# EAGLE design alu (EAGLE 9.6.2)
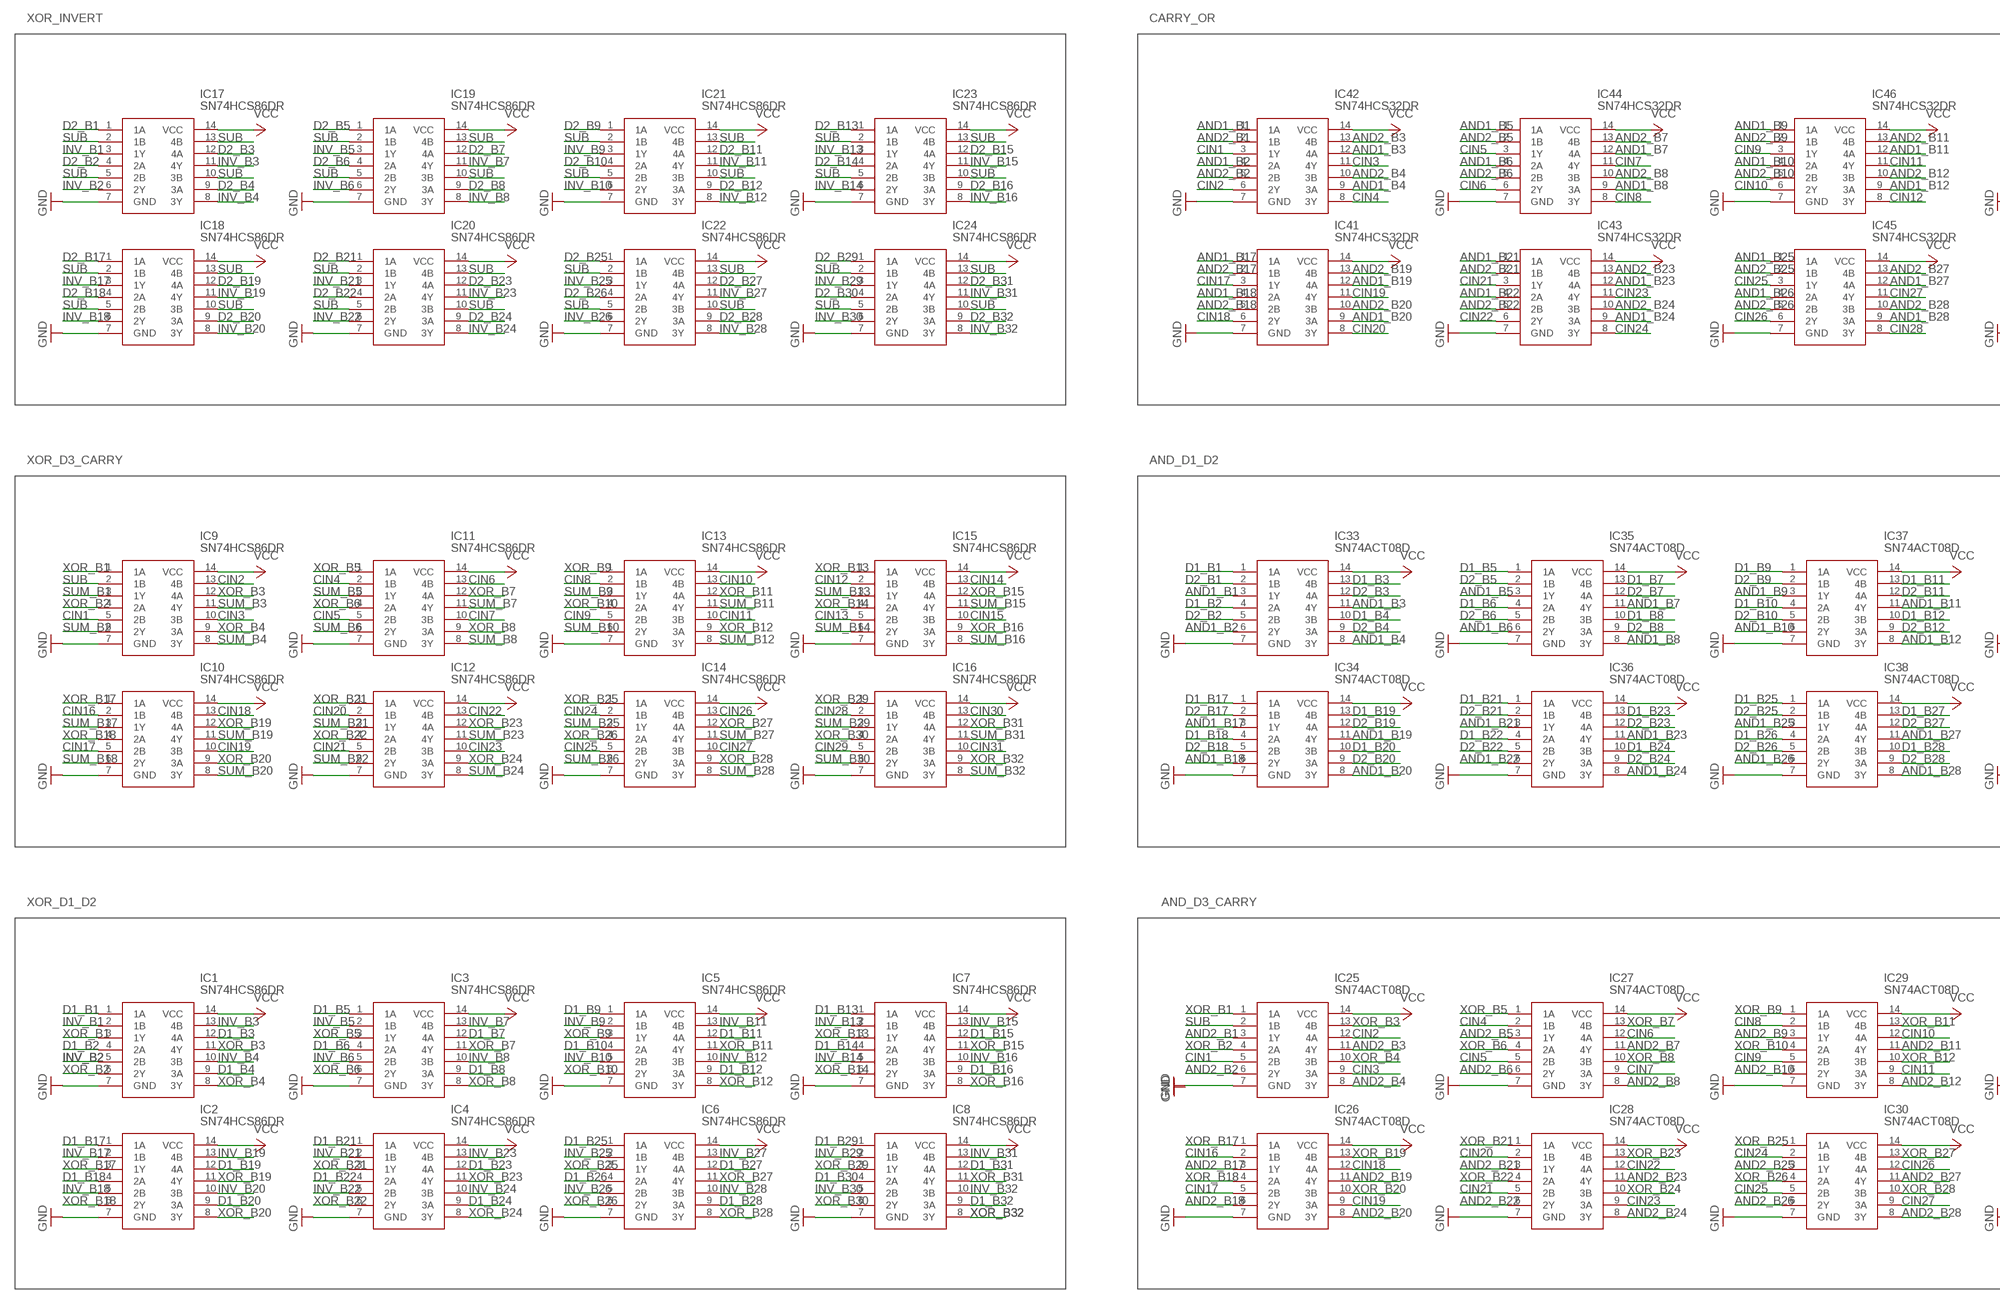
[diagram p0: schematic, sheet 1, part 1 of 2]
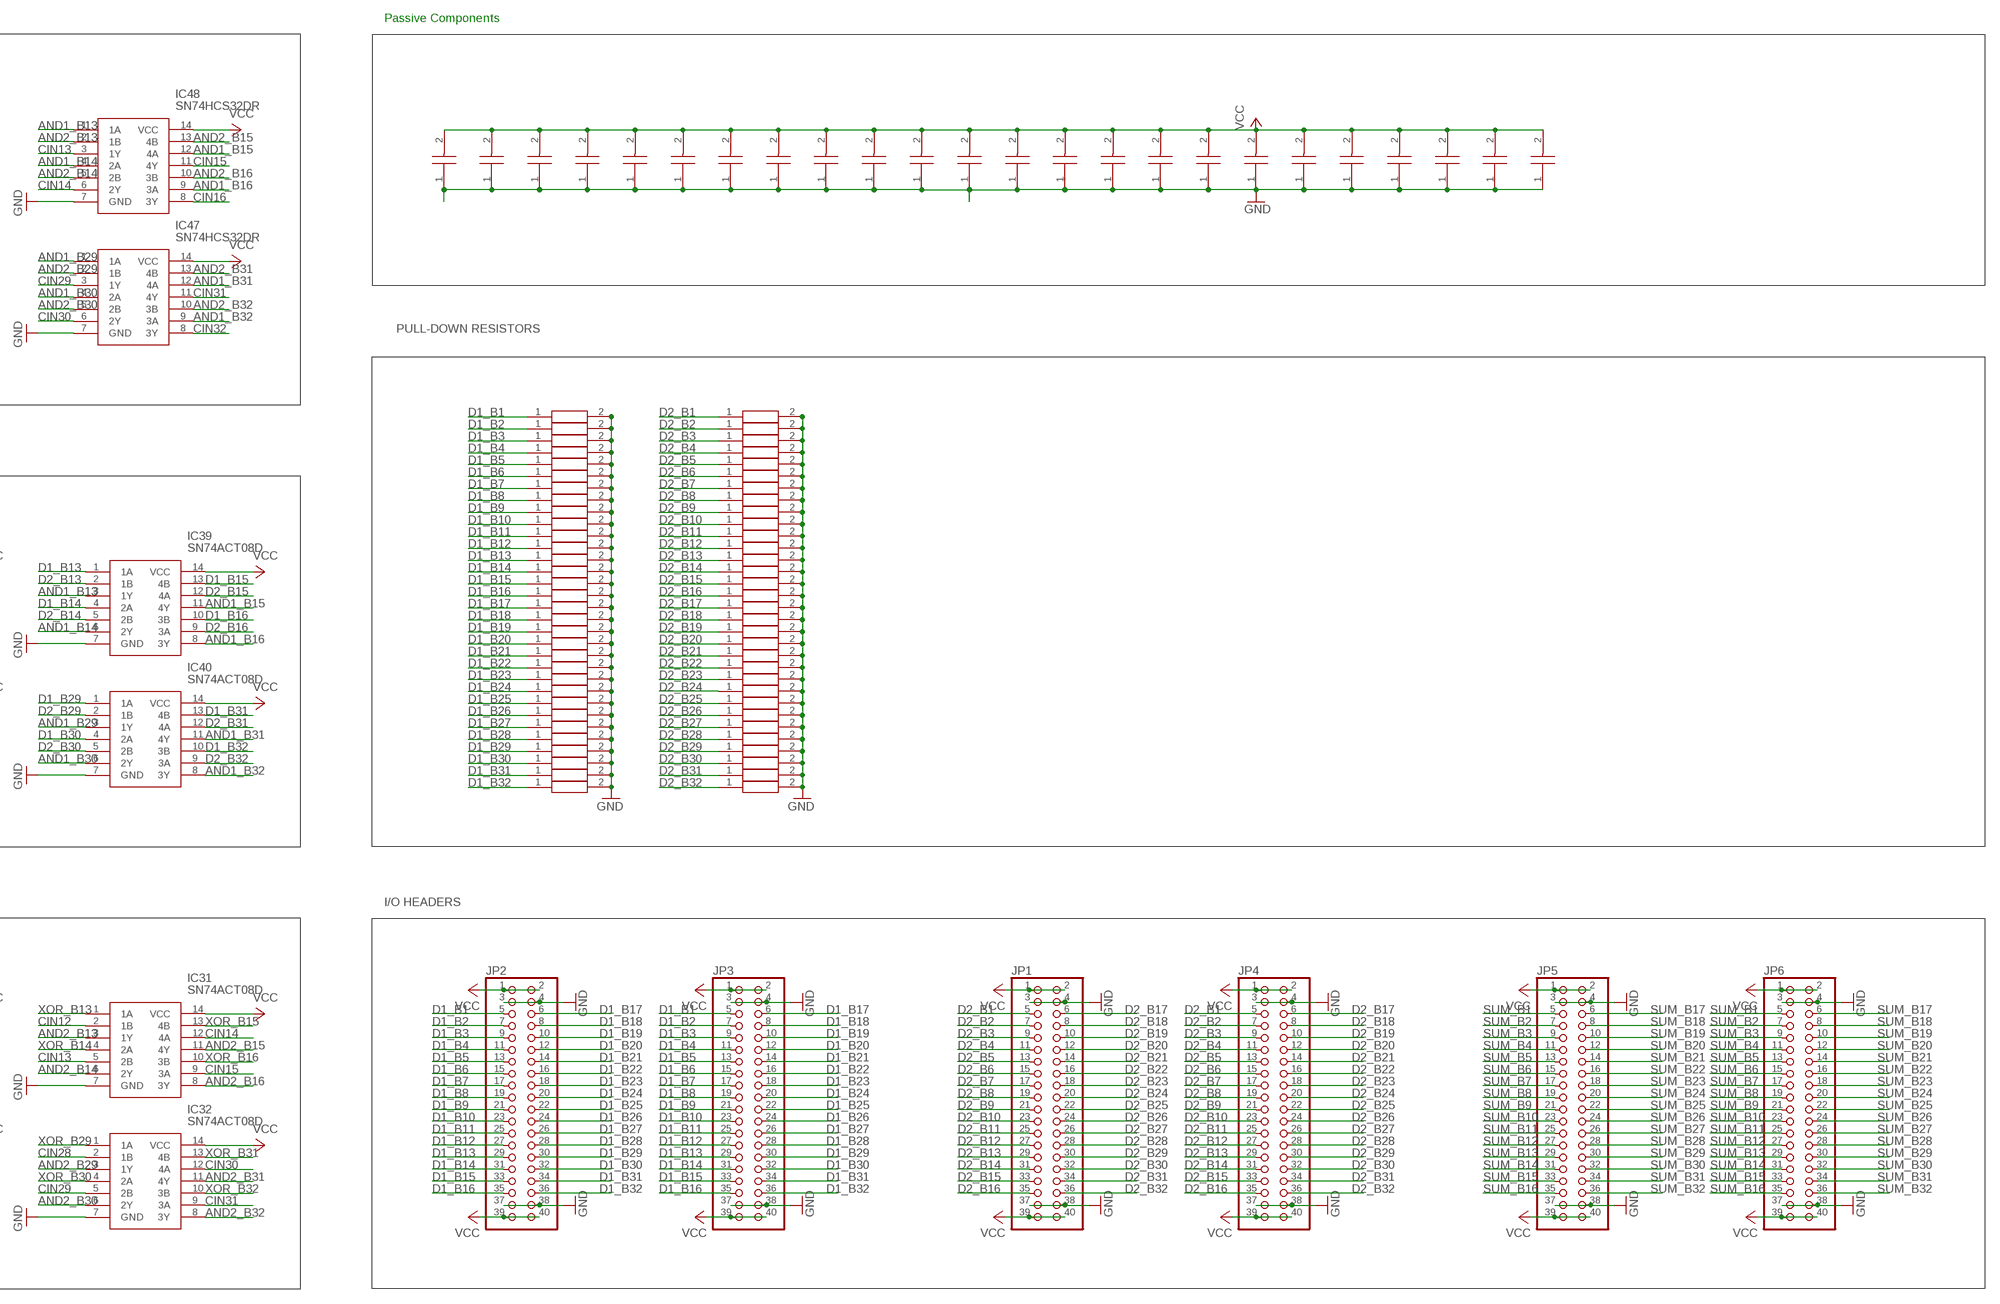
[diagram p1: schematic, sheet 1, part 2 of 2]

## Parts
C1  CC0603KRX7R9BB104  [CAPC1608X90N]
C2  CC0603KRX7R9BB104  [CAPC1608X90N]
C3  CC0603KRX7R9BB104  [CAPC1608X90N]
C4  CC0603KRX7R9BB104  [CAPC1608X90N]
C5  CC0603KRX7R9BB104  [CAPC1608X90N]
C6  CC0603KRX7R9BB104  [CAPC1608X90N]
C7  CC0603KRX7R9BB104  [CAPC1608X90N]
C8  CC0603KRX7R9BB104  [CAPC1608X90N]
C9  CC0603KRX7R9BB104  [CAPC1608X90N]
C10  CC0603KRX7R9BB104  [CAPC1608X90N]
C11  CC0603KRX7R9BB104  [CAPC1608X90N]
C12  CC0603KRX7R9BB104  [CAPC1608X90N]
C13  CC0603KRX7R9BB104  [CAPC1608X90N]
C14  CC0603KRX7R9BB104  [CAPC1608X90N]
C15  CC0603KRX7R9BB104  [CAPC1608X90N]
C16  CC0603KRX7R9BB104  [CAPC1608X90N]
C17  CC0603KRX7R9BB104  [CAPC1608X90N]
C18  CC0603KRX7R9BB104  [CAPC1608X90N]
C19  CC0603KRX7R9BB104  [CAPC1608X90N]
C20  CC0603KRX7R9BB104  [CAPC1608X90N]
C21  CC0603KRX7R9BB104  [CAPC1608X90N]
C22  CC0603KRX7R9BB104  [CAPC1608X90N]
C23  CC0603KRX7R9BB104  [CAPC1608X90N]
C24  CC0603KRX7R9BB104  [CAPC1608X90N]
IC1  SN74HCS86DR  [SOIC127P600X175-14N]
IC2  SN74HCS86DR  [SOIC127P600X175-14N]
IC3  SN74HCS86DR  [SOIC127P600X175-14N]
IC4  SN74HCS86DR  [SOIC127P600X175-14N]
IC5  SN74HCS86DR  [SOIC127P600X175-14N]
IC6  SN74HCS86DR  [SOIC127P600X175-14N]
IC7  SN74HCS86DR  [SOIC127P600X175-14N]
IC8  SN74HCS86DR  [SOIC127P600X175-14N]
IC9  SN74HCS86DR  [SOIC127P600X175-14N]
IC10  SN74HCS86DR  [SOIC127P600X175-14N]
IC11  SN74HCS86DR  [SOIC127P600X175-14N]
IC12  SN74HCS86DR  [SOIC127P600X175-14N]
IC13  SN74HCS86DR  [SOIC127P600X175-14N]
IC14  SN74HCS86DR  [SOIC127P600X175-14N]
IC15  SN74HCS86DR  [SOIC127P600X175-14N]
IC16  SN74HCS86DR  [SOIC127P600X175-14N]
IC17  SN74HCS86DR  [SOIC127P600X175-14N]
IC18  SN74HCS86DR  [SOIC127P600X175-14N]
IC19  SN74HCS86DR  [SOIC127P600X175-14N]
IC20  SN74HCS86DR  [SOIC127P600X175-14N]
IC21  SN74HCS86DR  [SOIC127P600X175-14N]
IC22  SN74HCS86DR  [SOIC127P600X175-14N]
IC23  SN74HCS86DR  [SOIC127P600X175-14N]
IC24  SN74HCS86DR  [SOIC127P600X175-14N]
IC25  SN74ACT08D  [SOIC127P600X175-14N]
IC26  SN74ACT08D  [SOIC127P600X175-14N]
IC27  SN74ACT08D  [SOIC127P600X175-14N]
IC28  SN74ACT08D  [SOIC127P600X175-14N]
IC29  SN74ACT08D  [SOIC127P600X175-14N]
IC30  SN74ACT08D  [SOIC127P600X175-14N]
IC31  SN74ACT08D  [SOIC127P600X175-14N]
IC32  SN74ACT08D  [SOIC127P600X175-14N]
IC33  SN74ACT08D  [SOIC127P600X175-14N]
IC34  SN74ACT08D  [SOIC127P600X175-14N]
IC35  SN74ACT08D  [SOIC127P600X175-14N]
IC36  SN74ACT08D  [SOIC127P600X175-14N]
IC37  SN74ACT08D  [SOIC127P600X175-14N]
IC38  SN74ACT08D  [SOIC127P600X175-14N]
IC39  SN74ACT08D  [SOIC127P600X175-14N]
IC40  SN74ACT08D  [SOIC127P600X175-14N]
IC41  SN74HCS32DR  [SOIC127P600X175-14N]
IC42  SN74HCS32DR  [SOIC127P600X175-14N]
IC43  SN74HCS32DR  [SOIC127P600X175-14N]
IC44  SN74HCS32DR  [SOIC127P600X175-14N]
IC45  SN74HCS32DR  [SOIC127P600X175-14N]
IC46  SN74HCS32DR  [SOIC127P600X175-14N]
IC47  SN74HCS32DR  [SOIC127P600X175-14N]
IC48  SN74HCS32DR  [SOIC127P600X175-14N]
JP1  PINHD-2X20  [2X20]
JP2  PINHD-2X20  [2X20]
JP3  PINHD-2X20  [2X20]
JP4  PINHD-2X20  [2X20]
JP5  PINHD-2X20  [2X20]
JP6  PINHD-2X20  [2X20]
R1  RC0603FR-0710KL  [RESC1608X55N]
R2  RC0603FR-0710KL  [RESC1608X55N]
R3  RC0603FR-0710KL  [RESC1608X55N]
R4  RC0603FR-0710KL  [RESC1608X55N]
R5  RC0603FR-0710KL  [RESC1608X55N]
R6  RC0603FR-0710KL  [RESC1608X55N]
R7  RC0603FR-0710KL  [RESC1608X55N]
R8  RC0603FR-0710KL  [RESC1608X55N]
R9  RC0603FR-0710KL  [RESC1608X55N]
R10  RC0603FR-0710KL  [RESC1608X55N]
R11  RC0603FR-0710KL  [RESC1608X55N]
R12  RC0603FR-0710KL  [RESC1608X55N]
R13  RC0603FR-0710KL  [RESC1608X55N]
R14  RC0603FR-0710KL  [RESC1608X55N]
R15  RC0603FR-0710KL  [RESC1608X55N]
R16  RC0603FR-0710KL  [RESC1608X55N]
R17  RC0603FR-0710KL  [RESC1608X55N]
R18  RC0603FR-0710KL  [RESC1608X55N]
R19  RC0603FR-0710KL  [RESC1608X55N]
R20  RC0603FR-0710KL  [RESC1608X55N]
R21  RC0603FR-0710KL  [RESC1608X55N]
R22  RC0603FR-0710KL  [RESC1608X55N]
R23  RC0603FR-0710KL  [RESC1608X55N]
R24  RC0603FR-0710KL  [RESC1608X55N]
R25  RC0603FR-0710KL  [RESC1608X55N]
R26  RC0603FR-0710KL  [RESC1608X55N]
R27  RC0603FR-0710KL  [RESC1608X55N]
R28  RC0603FR-0710KL  [RESC1608X55N]
R29  RC0603FR-0710KL  [RESC1608X55N]
R30  RC0603FR-0710KL  [RESC1608X55N]
R31  RC0603FR-0710KL  [RESC1608X55N]
R32  RC0603FR-0710KL  [RESC1608X55N]
R33  RC0603FR-0710KL  [RESC1608X55N]
R34  RC0603FR-0710KL  [RESC1608X55N]
R35  RC0603FR-0710KL  [RESC1608X55N]
R36  RC0603FR-0710KL  [RESC1608X55N]
R37  RC0603FR-0710KL  [RESC1608X55N]
R38  RC0603FR-0710KL  [RESC1608X55N]
R39  RC0603FR-0710KL  [RESC1608X55N]
R40  RC0603FR-0710KL  [RESC1608X55N]
R41  RC0603FR-0710KL  [RESC1608X55N]
R42  RC0603FR-0710KL  [RESC1608X55N]
R43  RC0603FR-0710KL  [RESC1608X55N]
R44  RC0603FR-0710KL  [RESC1608X55N]
R45  RC0603FR-0710KL  [RESC1608X55N]
R46  RC0603FR-0710KL  [RESC1608X55N]
R47  RC0603FR-0710KL  [RESC1608X55N]
R48  RC0603FR-0710KL  [RESC1608X55N]
R49  RC0603FR-0710KL  [RESC1608X55N]
R50  RC0603FR-0710KL  [RESC1608X55N]
R51  RC0603FR-0710KL  [RESC1608X55N]
R52  RC0603FR-0710KL  [RESC1608X55N]
R53  RC0603FR-0710KL  [RESC1608X55N]
R54  RC0603FR-0710KL  [RESC1608X55N]
R55  RC0603FR-0710KL  [RESC1608X55N]
R56  RC0603FR-0710KL  [RESC1608X55N]
R57  RC0603FR-0710KL  [RESC1608X55N]
R58  RC0603FR-0710KL  [RESC1608X55N]
R59  RC0603FR-0710KL  [RESC1608X55N]
R60  RC0603FR-0710KL  [RESC1608X55N]
R61  RC0603FR-0710KL  [RESC1608X55N]
R62  RC0603FR-0710KL  [RESC1608X55N]
R63  RC0603FR-0710KL  [RESC1608X55N]
R64  RC0603FR-0710KL  [RESC1608X55N]

## Nets
AND1_B1: IC33.3(1Y) IC42.1(1A)
AND1_B2: IC33.6(2Y) IC42.4(2A)
AND1_B3: IC33.11(4Y) IC42.12(4A)
AND1_B4: IC33.8(3Y) IC42.9(3A)
AND1_B5: IC35.3(1Y) IC44.1(1A)
AND1_B6: IC35.6(2Y) IC44.4(2A)
AND1_B7: IC35.11(4Y) IC44.12(4A)
AND1_B8: IC35.8(3Y) IC44.9(3A)
AND1_B9: IC37.3(1Y) IC46.1(1A)
AND1_B10: IC37.6(2Y) IC46.4(2A)
AND1_B11: IC37.11(4Y) IC46.12(4A)
AND1_B12: IC37.8(3Y) IC46.9(3A)
AND1_B13: IC39.3(1Y) IC48.1(1A)
AND1_B14: IC39.6(2Y) IC48.4(2A)
AND1_B15: IC39.11(4Y) IC48.12(4A)
AND1_B16: IC39.8(3Y) IC48.9(3A)
AND1_B17: IC34.3(1Y) IC41.1(1A)
AND1_B18: IC34.6(2Y) IC41.4(2A)
AND1_B19: IC34.11(4Y) IC41.12(4A)
AND1_B20: IC34.8(3Y) IC41.9(3A)
AND1_B21: IC36.3(1Y) IC43.1(1A)
AND1_B22: IC36.6(2Y) IC43.4(2A)
AND1_B23: IC36.11(4Y) IC43.12(4A)
AND1_B24: IC36.8(3Y) IC43.9(3A)
AND1_B25: IC38.3(1Y) IC45.1(1A)
AND1_B26: IC38.6(2Y) IC45.4(2A)
AND1_B27: IC38.11(4Y) IC45.12(4A)
AND1_B28: IC38.8(3Y) IC45.9(3A)
AND1_B29: IC40.3(1Y) IC47.1(1A)
AND1_B30: IC40.6(2Y) IC47.4(2A)
AND1_B31: IC40.11(4Y) IC47.12(4A)
AND1_B32: IC40.8(3Y) IC47.9(3A)
AND2_B1: IC25.3(1Y) IC42.2(1B)
AND2_B2: IC25.6(2Y) IC42.5(2B)
AND2_B3: IC25.11(4Y) IC42.13(4B)
AND2_B4: IC25.8(3Y) IC42.10(3B)
AND2_B5: IC27.3(1Y) IC44.2(1B)
AND2_B6: IC27.6(2Y) IC44.5(2B)
AND2_B7: IC27.11(4Y) IC44.13(4B)
AND2_B8: IC27.8(3Y) IC44.10(3B)
AND2_B9: IC29.3(1Y) IC46.2(1B)
AND2_B10: IC29.6(2Y) IC46.5(2B)
AND2_B11: IC29.11(4Y) IC46.13(4B)
AND2_B12: IC29.8(3Y) IC46.10(3B)
AND2_B13: IC31.3(1Y) IC48.2(1B)
AND2_B14: IC31.6(2Y) IC48.5(2B)
AND2_B15: IC31.11(4Y) IC48.13(4B)
AND2_B16: IC31.8(3Y) IC48.10(3B)
AND2_B17: IC26.3(1Y) IC41.2(1B)
AND2_B18: IC26.6(2Y) IC41.5(2B)
AND2_B19: IC26.11(4Y) IC41.13(4B)
AND2_B20: IC26.8(3Y) IC41.10(3B)
AND2_B21: IC28.3(1Y) IC43.2(1B)
AND2_B22: IC28.6(2Y) IC43.5(2B)
AND2_B23: IC28.11(4Y) IC43.13(4B)
AND2_B24: IC28.8(3Y) IC43.10(3B)
AND2_B25: IC30.3(1Y) IC45.2(1B)
AND2_B26: IC30.6(2Y) IC45.5(2B)
AND2_B27: IC30.11(4Y) IC45.13(4B)
AND2_B28: IC30.8(3Y) IC45.10(3B)
AND2_B29: IC32.3(1Y) IC47.2(1B)
AND2_B30: IC32.6(2Y) IC47.5(2B)
AND2_B31: IC32.11(4Y) IC47.13(4B)
AND2_B32: IC32.8(3Y) IC47.10(3B)
CIN1: IC9.5(2B) IC25.5(2B) IC42.3(1Y)
CIN2: IC9.13(4B) IC25.12(4A) IC42.6(2Y)
CIN3: IC9.10(3B) IC25.9(3A) IC42.11(4Y)
CIN4: IC11.2(1B) IC27.2(1B) IC42.8(3Y)
CIN5: IC11.5(2B) IC27.5(2B) IC44.3(1Y)
CIN6: IC11.13(4B) IC27.12(4A) IC44.6(2Y)
CIN7: IC11.10(3B) IC27.9(3A) IC44.11(4Y)
CIN8: IC13.2(1B) IC29.2(1B) IC44.8(3Y)
CIN9: IC13.5(2B) IC29.5(2B) IC46.3(1Y)
CIN10: IC13.13(4B) IC29.12(4A) IC46.6(2Y)
CIN11: IC13.10(3B) IC29.9(3A) IC46.11(4Y)
CIN12: IC15.2(1B) IC31.2(1B) IC46.8(3Y)
CIN13: IC15.5(2B) IC31.5(2B) IC48.3(1Y)
CIN14: IC15.13(4B) IC31.12(4A) IC48.6(2Y)
CIN15: IC15.10(3B) IC31.9(3A) IC48.11(4Y)
CIN16: IC10.2(1B) IC26.2(1B) IC48.8(3Y)
CIN17: IC10.5(2B) IC26.5(2B) IC41.3(1Y)
CIN18: IC10.13(4B) IC26.12(4A) IC41.6(2Y)
CIN19: IC10.10(3B) IC26.9(3A) IC41.11(4Y)
CIN20: IC12.2(1B) IC28.2(1B) IC41.8(3Y)
CIN21: IC12.5(2B) IC28.5(2B) IC43.3(1Y)
CIN22: IC12.13(4B) IC28.12(4A) IC43.6(2Y)
CIN23: IC12.10(3B) IC28.9(3A) IC43.11(4Y)
CIN24: IC14.2(1B) IC30.2(1B) IC43.8(3Y)
CIN25: IC14.5(2B) IC30.5(2B) IC45.3(1Y)
CIN26: IC14.13(4B) IC30.12(4A) IC45.6(2Y)
CIN27: IC14.10(3B) IC30.9(3A) IC45.11(4Y)
CIN28: IC16.2(1B) IC32.2(1B) IC45.8(3Y)
CIN29: IC16.5(2B) IC32.5(2B) IC47.3(1Y)
CIN30: IC16.13(4B) IC32.12(4A) IC47.6(2Y)
CIN31: IC16.10(3B) IC32.9(3A) IC47.11(4Y)
CIN32: IC47.8(3Y)
D1_B1: IC1.1(1A) IC33.1(1A) JP2.5 JP3.5 R1.1
D1_B2: IC1.4(2A) IC33.4(2A) JP2.7 JP3.7 R2.1
D1_B3: IC1.12(4A) IC33.13(4B) JP2.9 JP3.9 R3.1
D1_B4: IC1.9(3A) IC33.10(3B) JP2.11 JP3.11 R4.1
D1_B5: IC3.1(1A) IC35.1(1A) JP2.13 JP3.13 R5.1
D1_B6: IC3.4(2A) IC35.4(2A) JP2.15 JP3.15 R6.1
D1_B7: IC3.12(4A) IC35.13(4B) JP2.17 JP3.17 R7.1
D1_B8: IC3.9(3A) IC35.10(3B) JP2.19 JP3.19 R8.1
D1_B9: IC5.1(1A) IC37.1(1A) JP2.21 JP3.21 R9.1
D1_B10: IC5.4(2A) IC37.4(2A) JP2.23 JP3.23 R10.1
D1_B11: IC5.12(4A) IC37.13(4B) JP2.25 JP3.25 R11.1
D1_B12: IC5.9(3A) IC37.10(3B) JP2.27 JP3.27 R12.1
D1_B13: IC7.1(1A) IC39.1(1A) JP2.29 JP3.29 R13.1
D1_B14: IC7.4(2A) IC39.4(2A) JP2.31 JP3.31 R14.1
D1_B15: IC7.12(4A) IC39.13(4B) JP2.33 JP3.33 R15.1
D1_B16: IC7.9(3A) IC39.10(3B) JP2.35 JP3.35 R17.1
D1_B17: IC2.1(1A) IC34.1(1A) JP2.6 JP3.6 R16.1
D1_B18: IC2.4(2A) IC34.4(2A) JP2.8 JP3.8 R18.1
D1_B19: IC2.12(4A) IC34.13(4B) JP2.10 JP3.10 R19.1
D1_B20: IC2.9(3A) IC34.10(3B) JP2.12 JP3.12 R20.1
D1_B21: IC4.1(1A) IC36.1(1A) JP2.14 JP3.14 R21.1
D1_B22: IC4.4(2A) IC36.4(2A) JP2.16 JP3.16 R22.1
D1_B23: IC4.12(4A) IC36.13(4B) JP2.18 JP3.18 R23.1
D1_B24: IC4.9(3A) IC36.10(3B) JP2.20 JP3.20 R24.1
D1_B25: IC6.1(1A) IC38.1(1A) JP2.22 JP3.22 R26.1
D1_B26: IC6.4(2A) IC38.4(2A) JP2.24 JP3.24 R25.1
D1_B27: IC6.12(4A) IC38.13(4B) JP2.26 JP3.26 R27.1
D1_B28: IC6.9(3A) IC38.10(3B) JP2.28 JP3.28 R28.1
D1_B29: IC8.1(1A) IC40.1(1A) JP2.30 JP3.30 R29.1
D1_B30: IC8.4(2A) IC40.4(2A) JP2.32 JP3.32 R30.1
D1_B31: IC8.12(4A) IC40.13(4B) JP2.34 JP3.34 R31.1
D1_B32: IC8.9(3A) IC40.10(3B) JP2.36 JP3.36 R32.1
D2_B1: IC17.1(1A) IC33.2(1B) JP1.5 JP4.5 R33.1
D2_B2: IC17.4(2A) IC33.5(2B) JP1.7 JP4.7 R34.1
D2_B3: IC17.12(4A) IC33.12(4A) JP1.9 JP4.9 R35.1
D2_B4: IC17.9(3A) IC33.9(3A) JP1.11 JP4.11 R36.1
D2_B5: IC19.1(1A) IC35.2(1B) JP1.13 JP4.13 R37.1
D2_B6: IC19.4(2A) IC35.5(2B) JP1.15 JP4.15 R38.1
D2_B7: IC19.12(4A) IC35.12(4A) JP1.17 JP4.17 R39.1
D2_B8: IC19.9(3A) IC35.9(3A) JP1.19 JP4.19 R40.1
D2_B9: IC21.1(1A) IC37.2(1B) JP1.21 JP4.21 R41.1
D2_B10: IC21.4(2A) IC37.5(2B) JP1.23 JP4.23 R42.1
D2_B11: IC21.12(4A) IC37.12(4A) JP1.25 JP4.25 R43.1
D2_B12: IC21.9(3A) IC37.9(3A) JP1.27 JP4.27 R44.1
D2_B13: IC23.1(1A) IC39.2(1B) JP1.29 JP4.29 R45.1
D2_B14: IC23.4(2A) IC39.5(2B) JP1.31 JP4.31 R46.1
D2_B15: IC23.12(4A) IC39.12(4A) JP1.33 JP4.33 R47.1
D2_B16: IC23.9(3A) IC39.9(3A) JP1.35 JP4.35 R49.1
D2_B17: IC18.1(1A) IC34.2(1B) JP1.6 JP4.6 R48.1
D2_B18: IC18.4(2A) IC34.5(2B) JP1.8 JP4.8 R50.1
D2_B19: IC18.12(4A) IC34.12(4A) JP1.10 JP4.10 R51.1
D2_B20: IC18.9(3A) IC34.9(3A) JP1.12 JP4.12 R52.1
D2_B21: IC20.1(1A) IC36.2(1B) JP1.14 JP4.14 R53.1
D2_B22: IC20.4(2A) IC36.5(2B) JP1.16 JP4.16 R54.1
D2_B23: IC20.12(4A) IC36.12(4A) JP1.18 JP4.18 R55.1
D2_B24: IC20.9(3A) IC36.9(3A) JP1.20 JP4.20 R56.1
D2_B25: IC22.1(1A) IC38.2(1B) JP1.22 JP4.22 R58.1
D2_B26: IC22.4(2A) IC38.5(2B) JP1.24 JP4.24 R57.1
D2_B27: IC22.12(4A) IC38.12(4A) JP1.26 JP4.26 R59.1
D2_B28: IC22.9(3A) IC38.9(3A) JP1.28 JP4.28 R60.1
D2_B29: IC24.1(1A) IC40.2(1B) JP1.30 JP4.30 R61.1
D2_B30: IC24.4(2A) IC40.5(2B) JP1.32 JP4.32 R62.1
D2_B31: IC24.12(4A) IC40.12(4A) JP1.34 JP4.34 R63.1
D2_B32: IC24.9(3A) IC40.9(3A) JP1.36 JP4.36 R64.1
GND: C1.1 C2.1 C3.1 C4.1 C5.1 C6.1 C7.1 C8.1 C9.1 C10.1 C11.1 C12.1 C13.1 C14.1 C15.1 C16.1 C17.1 C18.1 C19.1 C20.1 C21.1 C22.1 C23.1 C24.1 IC1.7(GND) IC2.7(GND) IC3.7(GND) IC4.7(GND) IC5.7(GND) IC6.7(GND) IC7.7(GND) IC8.7(GND) IC9.7(GND) IC10.7(GND) IC11.7(GND) IC12.7(GND) IC13.7(GND) IC14.7(GND) IC15.7(GND) IC16.7(GND) IC17.7(GND) IC18.7(GND) IC19.7(GND) IC20.7(GND) IC21.7(GND) IC22.7(GND) IC23.7(GND) IC24.7(GND) IC25.7(GND) IC26.7(GND) IC27.7(GND) IC28.7(GND) IC29.7(GND) IC30.7(GND) IC31.7(GND) IC32.7(GND) IC33.7(GND) IC34.7(GND) IC35.7(GND) IC36.7(GND) IC37.7(GND) IC38.7(GND) IC39.7(GND) IC40.7(GND) IC41.7(GND) IC42.7(GND) IC43.7(GND) IC44.7(GND) IC45.7(GND) IC46.7(GND) IC47.7(GND) IC48.7(GND) JP1.3 JP1.4 JP1.37 JP1.38 JP2.3 JP2.4 JP2.37 JP2.38 JP3.3 JP3.4 JP3.37 JP3.38 JP4.3 JP4.4 JP4.37 JP4.38 JP5.3 JP5.4 JP5.37 JP5.38 JP6.3 JP6.4 JP6.37 JP6.38 R1.2 R2.2 R3.2 R4.2 R5.2 R6.2 R7.2 R8.2 R9.2 R10.2 R11.2 R12.2 R13.2 R14.2 R15.2 R16.2 R17.2 R18.2 R19.2 R20.2 R21.2 R22.2 R23.2 R24.2 R25.2 R26.2 R27.2 R28.2 R29.2 R30.2 R31.2 R32.2 R33.2 R34.2 R35.2 R36.2 R37.2 R38.2 R39.2 R40.2 R41.2 R42.2 R43.2 R44.2 R45.2 R46.2 R47.2 R48.2 R49.2 R50.2 R51.2 R52.2 R53.2 R54.2 R55.2 R56.2 R57.2 R58.2 R59.2 R60.2 R61.2 R62.2 R63.2 R64.2
INV_B1: IC1.2(1B) IC17.3(1Y)
INV_B2: IC1.5(2B) IC17.6(2Y)
INV_B3: IC1.13(4B) IC17.11(4Y)
INV_B4: IC1.10(3B) IC17.8(3Y)
INV_B5: IC3.2(1B) IC19.3(1Y)
INV_B6: IC3.5(2B) IC19.6(2Y)
INV_B7: IC3.13(4B) IC19.11(4Y)
INV_B8: IC3.10(3B) IC19.8(3Y)
INV_B9: IC5.2(1B) IC21.3(1Y)
INV_B10: IC5.5(2B) IC21.6(2Y)
INV_B11: IC5.13(4B) IC21.11(4Y)
INV_B12: IC5.10(3B) IC21.8(3Y)
INV_B13: IC7.2(1B) IC23.3(1Y)
INV_B14: IC7.5(2B) IC23.6(2Y)
INV_B15: IC7.13(4B) IC23.11(4Y)
INV_B16: IC7.10(3B) IC23.8(3Y)
INV_B17: IC2.2(1B) IC18.3(1Y)
INV_B18: IC2.5(2B) IC18.6(2Y)
INV_B19: IC2.13(4B) IC18.11(4Y)
INV_B20: IC2.10(3B) IC18.8(3Y)
INV_B21: IC4.2(1B) IC20.3(1Y)
INV_B22: IC4.5(2B) IC20.6(2Y)
INV_B23: IC4.13(4B) IC20.11(4Y)
INV_B24: IC4.10(3B) IC20.8(3Y)
INV_B25: IC6.2(1B) IC22.3(1Y)
INV_B26: IC6.5(2B) IC22.6(2Y)
INV_B27: IC6.13(4B) IC22.11(4Y)
INV_B28: IC6.10(3B) IC22.8(3Y)
INV_B29: IC8.2(1B) IC24.3(1Y)
INV_B30: IC8.5(2B) IC24.6(2Y)
INV_B31: IC8.13(4B) IC24.11(4Y)
INV_B32: IC8.10(3B) IC24.8(3Y)
SUB: IC9.2(1B) IC17.2(1B) IC17.5(2B) IC17.10(3B) IC17.13(4B) IC18.2(1B) IC18.5(2B) IC18.10(3B) IC18.13(4B) IC19.2(1B) IC19.5(2B) IC19.10(3B) IC19.13(4B) IC20.2(1B) IC20.5(2B) IC20.10(3B) IC20.13(4B) IC21.2(1B) IC21.5(2B) IC21.10(3B) IC21.13(4B) IC22.2(1B) IC22.5(2B) IC22.10(3B) IC22.13(4B) IC23.2(1B) IC23.5(2B) IC23.10(3B) IC23.13(4B) IC24.2(1B) IC24.5(2B) IC24.10(3B) IC24.13(4B) IC25.2(1B)
SUM_B1: IC9.3(1Y) JP5.5 JP6.5
SUM_B2: IC9.6(2Y) JP5.7 JP6.7
SUM_B3: IC9.11(4Y) JP5.9 JP6.9
SUM_B4: IC9.8(3Y) JP5.11 JP6.11
SUM_B5: IC11.3(1Y) JP5.13 JP6.13
SUM_B6: IC11.6(2Y) JP5.15 JP6.15
SUM_B7: IC11.11(4Y) JP5.17 JP6.17
SUM_B8: IC11.8(3Y) JP5.19 JP6.19
SUM_B9: IC13.3(1Y) JP5.21 JP6.21
SUM_B10: IC13.6(2Y) JP5.23 JP6.23
SUM_B11: IC13.11(4Y) JP5.25 JP6.25
SUM_B12: IC13.8(3Y) JP5.27 JP6.27
SUM_B13: IC15.3(1Y) JP5.29 JP6.29
SUM_B14: IC15.6(2Y) JP5.31 JP6.31
SUM_B15: IC15.11(4Y) JP5.33 JP6.33
SUM_B16: IC15.8(3Y) JP5.35 JP6.35
SUM_B17: IC10.3(1Y) JP5.6 JP6.6
SUM_B18: IC10.6(2Y) JP5.8 JP6.8
SUM_B19: IC10.11(4Y) JP5.10 JP6.10
SUM_B20: IC10.8(3Y) JP5.12 JP6.12
SUM_B21: IC12.3(1Y) JP5.14 JP6.14
SUM_B22: IC12.6(2Y) JP5.16 JP6.16
SUM_B23: IC12.11(4Y) JP5.18 JP6.18
SUM_B24: IC12.8(3Y) JP5.20 JP6.20
SUM_B25: IC14.3(1Y) JP5.22 JP6.22
SUM_B26: IC14.6(2Y) JP5.24 JP6.24
SUM_B27: IC14.11(4Y) JP5.26 JP6.26
SUM_B28: IC14.8(3Y) JP5.28 JP6.28
SUM_B29: IC16.3(1Y) JP5.30 JP6.30
SUM_B30: IC16.6(2Y) JP5.32 JP6.32
SUM_B31: IC16.11(4Y) JP5.34 JP6.34
SUM_B32: IC16.8(3Y) JP5.36 JP6.36
VCC [power]: C1.2 C2.2 C3.2 C4.2 C5.2 C6.2 C7.2 C8.2 C9.2 C10.2 C11.2 C12.2 C13.2 C14.2 C15.2 C16.2 C17.2 C18.2 C19.2 C20.2 C21.2 C22.2 C23.2 C24.2 IC1.14(VCC) IC2.14(VCC) IC3.14(VCC) IC4.14(VCC) IC5.14(VCC) IC6.14(VCC) IC7.14(VCC) IC8.14(VCC) IC9.14(VCC) IC10.14(VCC) IC11.14(VCC) IC12.14(VCC) IC13.14(VCC) IC14.14(VCC) IC15.14(VCC) IC16.14(VCC) IC17.14(VCC) IC18.14(VCC) IC19.14(VCC) IC20.14(VCC) IC21.14(VCC) IC22.14(VCC) IC23.14(VCC) IC24.14(VCC) IC25.14(VCC) IC26.14(VCC) IC27.14(VCC) IC28.14(VCC) IC29.14(VCC) IC30.14(VCC) IC31.14(VCC) IC32.14(VCC) IC33.14(VCC) IC34.14(VCC) IC35.14(VCC) IC36.14(VCC) IC37.14(VCC) IC38.14(VCC) IC39.14(VCC) IC40.14(VCC) IC41.14(VCC) IC42.14(VCC) IC43.14(VCC) IC44.14(VCC) IC45.14(VCC) IC46.14(VCC) IC47.14(VCC) IC48.14(VCC) JP1.1 JP1.2 JP1.39 JP1.40 JP2.1 JP2.2 JP2.39 JP2.40 JP3.1 JP3.2 JP3.39 JP3.40 JP4.1 JP4.2 JP4.39 JP4.40 JP5.1 JP5.2 JP5.39 JP5.40 JP6.1 JP6.2 JP6.39 JP6.40
XOR_B1: IC1.3(1Y) IC9.1(1A) IC25.1(1A)
XOR_B2: IC1.6(2Y) IC9.4(2A) IC25.4(2A)
XOR_B3: IC1.11(4Y) IC9.12(4A) IC25.13(4B)
XOR_B4: IC1.8(3Y) IC9.9(3A) IC25.10(3B)
XOR_B5: IC3.3(1Y) IC11.1(1A) IC27.1(1A)
XOR_B6: IC3.6(2Y) IC11.4(2A) IC27.4(2A)
XOR_B7: IC3.11(4Y) IC11.12(4A) IC27.13(4B)
XOR_B8: IC3.8(3Y) IC11.9(3A) IC27.10(3B)
XOR_B9: IC5.3(1Y) IC13.1(1A) IC29.1(1A)
XOR_B10: IC5.6(2Y) IC13.4(2A) IC29.4(2A)
XOR_B11: IC5.11(4Y) IC13.12(4A) IC29.13(4B)
XOR_B12: IC5.8(3Y) IC13.9(3A) IC29.10(3B)
XOR_B13: IC7.3(1Y) IC15.1(1A) IC31.1(1A)
XOR_B14: IC7.6(2Y) IC15.4(2A) IC31.4(2A)
XOR_B15: IC7.11(4Y) IC15.12(4A) IC31.13(4B)
XOR_B16: IC7.8(3Y) IC15.9(3A) IC31.10(3B)
XOR_B17: IC2.3(1Y) IC10.1(1A) IC26.1(1A)
XOR_B18: IC2.6(2Y) IC10.4(2A) IC26.4(2A)
XOR_B19: IC2.11(4Y) IC10.12(4A) IC26.13(4B)
XOR_B20: IC2.8(3Y) IC10.9(3A) IC26.10(3B)
XOR_B21: IC4.3(1Y) IC12.1(1A) IC28.1(1A)
XOR_B22: IC4.6(2Y) IC12.4(2A) IC28.4(2A)
XOR_B23: IC4.11(4Y) IC12.12(4A) IC28.13(4B)
XOR_B24: IC4.8(3Y) IC12.9(3A) IC28.10(3B)
XOR_B25: IC6.3(1Y) IC14.1(1A) IC30.1(1A)
XOR_B26: IC6.6(2Y) IC14.4(2A) IC30.4(2A)
XOR_B27: IC6.11(4Y) IC14.12(4A) IC30.13(4B)
XOR_B28: IC6.8(3Y) IC14.9(3A) IC30.10(3B)
XOR_B29: IC8.3(1Y) IC16.1(1A) IC32.1(1A)
XOR_B30: IC8.6(2Y) IC16.4(2A) IC32.4(2A)
XOR_B31: IC8.11(4Y) IC16.12(4A) IC32.13(4B)
XOR_B32: IC8.8(3Y) IC16.9(3A) IC32.10(3B)

## Notes on the sheet
- XOR_INVERT | CARRY_OR | Passive Components
- PULL-DOWN RESISTORS
- XOR_D3_CARRY | AND_D1_D2
- XOR_D1_D2 | AND_D3_CARRY | I/O HEADERS

## Library data of the parts
C1-C24 = CC0603KRX7R9BB104:CC0603KRX7R9BB104: CAPACITOR, 0603 100nF +/-10% 50V Source: Datasheet <http://componentsearchengine.com/Datasheets/3/CC0603KRX7R9BB104.pdf>; ARROW_PART_NUMBER: CC0603KRX7R9BB104; ARROW_PRICE-STOCK: https://www.arrow.com/en/products/cc0603krx7r9bb104/yageo?region=nac; DESCRIPTION: CAPACITOR, 0603 100nF +/-10% 50V; HEIGHT: 0.9mm; MANUFACTURER_NAME: YAGEO (PHYCOMP); MANUFACTURER_PART_NUMBER: CC0603KRX7R9BB104; MOUSER_PART_NUMBER: 603-CC603KRX7R9BB104; MOUSER_PRICE-STOCK: https://www.mouser.co.uk/ProductDetail/YAGEO/CC0603KRX7R9BB104?qs=vTakOoo5QyLvVCYM2ge8LQ%3D%3D
IC1-IC24 = SN74HCS86DR:SN74HCS86DR: Logic Gates Quadruple 2-input XOR gates with Schmitt-trigger inputs Source: Datasheet <https://www.ti.com/lit/gpn/sn74hcs86>; DESCRIPTION: Logic Gates Quadruple 2-input XOR gates with Schmitt-trigger inputs; HEIGHT: 1.75mm; MANUFACTURER_NAME: Texas Instruments; MANUFACTURER_PART_NUMBER: SN74HCS86DR; MOUSER_PART_NUMBER: 595-SN74HCS86DR; MOUSER_PRICE-STOCK: https://www.mouser.co.uk/ProductDetail/Texas-Instruments/SN74HCS86DR/?qs=7MVldsJ5Uax3N1HpQm%2FwtA%3D%3D
IC25-IC40 = SN74ACT08D:SN74ACT08D: Texas Instruments SN74ACT08D, AND Quad 2 Input AND, 4.5 5.5 V, 14-Pin SOIC Source: Datasheet <http://www.ti.com/lit/gpn/sn74act08>; ARROW_PART_NUMBER: SN74ACT08D; ARROW_PRICE-STOCK: https://www.arrow.com/en/products/sn74act08d/texas-instruments; DESCRIPTION: Texas Instruments SN74ACT08D, AND Quad 2 Input AND, 4.5 5.5 V, 14-Pin SOIC; HEIGHT: mm; MANUFACTURER_NAME: Texas Instruments; MANUFACTURER_PART_NUMBER: SN74ACT08D; MOUSER_PART_NUMBER: 595-SN74ACT08D; MOUSER_PRICE-STOCK: https://www.mouser.co.uk/ProductDetail/Texas-Instruments/SN74ACT08D?qs=d9gICRQKuCebaEBMy8%2FRJw%3D%3D
IC41-IC48 = SN74HCS32DR:SN74HCS32DR: Logic Gates Quadruple 2-input OR gates with Schmitt-trigger inputs 14-SOIC -40 to 125 Source: Datasheet <https://www.ti.com/lit/gpn/SN74HCS32>; ARROW_PART_NUMBER: SN74HCS32DR; ARROW_PRICE-STOCK: https://www.arrow.com/en/products/sn74hcs32dr/texas-instruments; DESCRIPTION: Logic Gates Quadruple 2-input OR gates with Schmitt-trigger inputs 14-SOIC -40 to 125; HEIGHT: 1.75mm; MANUFACTURER_NAME: Texas Instruments; MANUFACTURER_PART_NUMBER: SN74HCS32DR; MOUSER_PART_NUMBER: 595-SN74HCS32DR; MOUSER_PRICE-STOCK: https://www.mouser.co.uk/ProductDetail/Texas-Instruments/SN74HCS32DR?qs=7MVldsJ5Uay%2FXLwyM20zFg%3D%3D
JP1-JP6 = pinhead:PINHD-2X20: PIN HEADER
R1-R64 = RC0603FR-0710KL:RC0603FR-0710KL: Yageo RC Series Thick Film Surface Mount Resistor 0603 Case 10k Source: Datasheet <https://datasheet.datasheetarchive.com/originals/distributors/Datasheets_SAMA/902f9e387b938f871d31120f5fc1d65e.pdf>; ARROW_PART_NUMBER: RC0603FR-0710KL; ARROW_PRICE-STOCK: https://www.arrow.com/en/products/rc0603fr-0710kl/yageo?region=nac; DESCRIPTION: Yageo RC Series Thick Film Surface Mount Resistor 0603 Case 10k; HEIGHT: 0.55mm; MANUFACTURER_NAME: YAGEO (PHYCOMP); MANUFACTURER_PART_NUMBER: RC0603FR-0710KL; MOUSER_PART_NUMBER: 603-RC0603FR-0710KL; MOUSER_PRICE-STOCK: https://www.mouser.co.uk/ProductDetail/YAGEO/RC0603FR-0710KL?qs=grNVn54RoB%252B3GtjbJj3wJQ%3D%3D

## Board
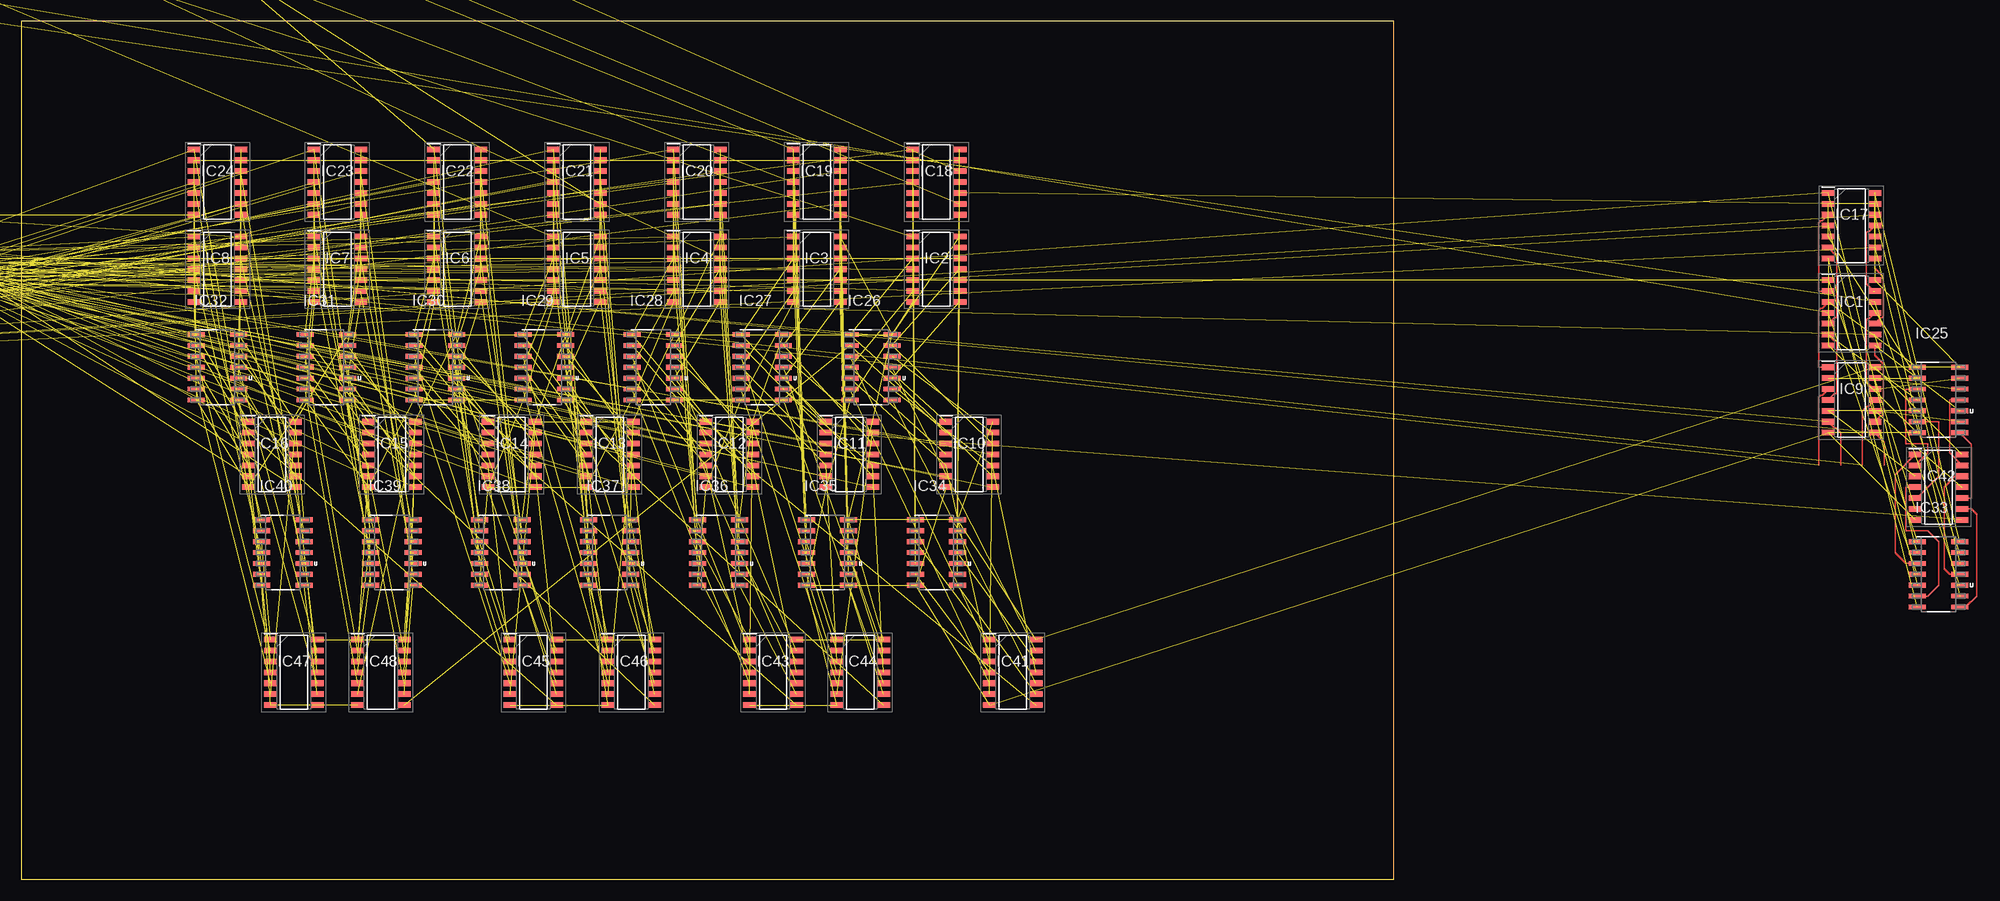
[diagram p2: board, top side]

Size 160 x 100 mm. Coordinates in mm from the lower left corner, seen from the top.
Outline: 0,0 160,0 160,100 0,100 0,0
Copper layers (1*16): Top 0.035mm / dielectric 1.5mm / Bottom 0.035mm
Design rules "default": minimum track width 6mil, minimum drill 0.35mm, track to track 6mil, track to pad 6mil, pad to pad 6mil, via to via 6mil, smd to smd 6mil, copper to edge 40mil, drill to drill 6mil, minimum pad ring 10mil, minimum via ring 8mil, stop-mask expansion 4mil, vias tented up to drill 0mil, thermal gap 10mil

### Footprints (pad centres in the part's own frame; a part is rotated, then mirrored left to right if it is on the bottom)
CAPC1608X90N = smd 0.83 x 0.94: 1 -0.66,0; 2 0.66,0
SOIC127P600X175-14N = smd 1.525 x 0.65: 1 -2.712,3.81; 2 -2.712,2.54; 3 -2.712,1.27; 4 -2.712,0; 5 -2.712,-1.27; 6 -2.712,-2.54; 7 -2.712,-3.81; 8 2.712,-3.81; 9 2.712,-2.54; 10 2.712,-1.27; 11 2.712,0; 12 2.712,1.27; 13 2.712,2.54; 14 2.712,3.81
SOIC127P600X175-14N' = smd 1.981 x 0.559: 1 -2.464,3.81; 2 -2.464,2.54; 3 -2.464,1.27; 4 -2.464,0; 5 -2.464,-1.27; 6 -2.464,-2.54; 7 -2.464,-3.81; 8 2.464,-3.81; 9 2.464,-2.54; 10 2.464,-1.27; 11 2.464,0; 12 2.464,1.27; 13 2.464,2.54; 14 2.464,3.81
2X20 = drill 1.016 octagon: 1 -24.13,-1.27; 2 -24.13,1.27; 3 -21.59,-1.27; 4 -21.59,1.27; 5 -19.05,-1.27; 6 -19.05,1.27; 7 -16.51,-1.27; 8 -16.51,1.27; 9 -13.97,-1.27; 10 -13.97,1.27; 11 -11.43,-1.27; 12 -11.43,1.27; 13 -8.89,-1.27; 14 -8.89,1.27; 15 -6.35,-1.27; 16 -6.35,1.27; 17 -3.81,-1.27; 18 -3.81,1.27; 19 -1.27,-1.27; 20 -1.27,1.27; 21 1.27,-1.27; 22 1.27,1.27; 23 3.81,-1.27; 24 3.81,1.27; 25 6.35,-1.27; 26 6.35,1.27; 27 8.89,-1.27; 28 8.89,1.27; 29 11.43,-1.27; 30 11.43,1.27; 31 13.97,-1.27; 32 13.97,1.27; 33 16.51,-1.27; 34 16.51,1.27; 35 19.05,-1.27; 36 19.05,1.27; 37 21.59,-1.27; 38 21.59,1.27; 39 24.13,-1.27; 40 24.13,1.27
RESC1608X55N = smd 0.8 x 0.95: 1 -0.8,0; 2 0.8,0

### Placement (x,y rotation side)
C1  -128.27,77.47 0 top  (outside the outline)
C2  -22.86,85.09 0 top  (outside the outline)
C3  -43.18,85.09 0 top  (outside the outline)
C4  -63.5,85.09 0 top  (outside the outline)
C5  -83.82,85.09 0 top  (outside the outline)
C6  -104.14,85.09 0 top  (outside the outline)
C7  -124.46,85.09 0 top  (outside the outline)
C8  -22.86,90.17 0 top  (outside the outline)
C9  -43.18,90.17 0 top  (outside the outline)
C10  -63.5,90.17 0 top  (outside the outline)
C11  -83.82,90.17 0 top  (outside the outline)
C12  -104.14,90.17 0 top  (outside the outline)
C13  -124.46,90.17 0 top  (outside the outline)
C14  -22.86,95.25 0 top  (outside the outline)
C15  -43.18,95.25 0 top  (outside the outline)
C16  -63.5,95.25 0 top  (outside the outline)
C17  -83.82,95.25 0 top  (outside the outline)
C18  -104.14,95.25 0 top  (outside the outline)
C19  -124.46,95.25 0 top  (outside the outline)
C20  -22.86,100.33 0 top  (outside the outline)
C21  -43.18,100.33 0 top  (outside the outline)
C22  -63.5,100.33 0 top  (outside the outline)
C23  -83.82,100.33 0 top  (outside the outline)
C24  -104.14,100.33 0 top  (outside the outline)
IC1  213.36,66.04 0 top  (outside the outline)
IC2  106.68,71.12 0 top
IC3  92.71,71.12 0 top
IC4  78.74,71.12 0 top
IC5  64.77,71.12 0 top
IC6  50.8,71.12 0 top
IC7  36.83,71.12 0 top
IC8  22.86,71.12 0 top
IC9  213.36,55.88 0 top  (outside the outline)
IC10  110.49,49.53 0 top
IC11  96.52,49.53 0 top
IC12  82.55,49.53 0 top
IC13  68.58,49.53 0 top
IC14  57.15,49.53 0 top
IC15  43.18,49.53 0 top
IC16  29.21,49.53 0 top
IC17  213.36,76.2 0 top  (outside the outline)
IC18  106.68,81.28 0 top
IC19  92.71,81.28 0 top
IC20  78.74,81.28 0 top
IC21  64.77,81.28 0 top
IC22  50.8,81.28 0 top
IC23  36.83,81.28 0 top
IC24  22.86,81.28 0 top
IC25  SN74ACT08D  [SOIC127P600X175-14N']  223.52,55.88 0 top  (outside the outline)
IC26  SN74ACT08D  [SOIC127P600X175-14N']  99.06,59.69 0 top
IC27  SN74ACT08D  [SOIC127P600X175-14N']  86.36,59.69 0 top
IC28  SN74ACT08D  [SOIC127P600X175-14N']  73.66,59.69 0 top
IC29  SN74ACT08D  [SOIC127P600X175-14N']  60.96,59.69 0 top
IC30  SN74ACT08D  [SOIC127P600X175-14N']  48.26,59.69 0 top
IC31  SN74ACT08D  [SOIC127P600X175-14N']  35.56,59.69 0 top
IC32  SN74ACT08D  [SOIC127P600X175-14N']  22.86,59.69 0 top
IC33  SN74ACT08D  [SOIC127P600X175-14N']  223.52,35.56 0 top  (outside the outline)
IC34  SN74ACT08D  [SOIC127P600X175-14N']  106.68,38.1 0 top
IC35  SN74ACT08D  [SOIC127P600X175-14N']  93.98,38.1 0 top
IC36  SN74ACT08D  [SOIC127P600X175-14N']  81.28,38.1 0 top
IC37  SN74ACT08D  [SOIC127P600X175-14N']  68.58,38.1 0 top
IC38  SN74ACT08D  [SOIC127P600X175-14N']  55.88,38.1 0 top
IC39  SN74ACT08D  [SOIC127P600X175-14N']  43.18,38.1 0 top
IC40  SN74ACT08D  [SOIC127P600X175-14N']  30.48,38.1 0 top
IC41  115.57,24.13 0 top
IC42  223.52,45.72 0 top  (outside the outline)
IC43  87.63,24.13 0 top
IC44  97.79,24.13 0 top
IC45  59.69,24.13 0 top
IC46  71.12,24.13 0 top
IC47  31.75,24.13 0 top
IC48  41.91,24.13 0 top
JP1  -53.34,60.96 0 top  (outside the outline)
JP2  -105.41,60.96 0 top  (outside the outline)
JP3  -39.37,71.12 0 top  (outside the outline)
JP4  -91.44,71.12 0 top  (outside the outline)
JP5  -39.37,78.74 0 top  (outside the outline)
JP6  -91.44,78.74 0 top  (outside the outline)
R1  -123.19,100.33 0 top  (outside the outline)
R2  -21.59,105.41 0 top  (outside the outline)
R3  -39.37,105.41 0 top  (outside the outline)
R4  -57.15,105.41 0 top  (outside the outline)
R5  -74.93,105.41 0 top  (outside the outline)
R6  -92.71,105.41 0 top  (outside the outline)
R7  -110.49,105.41 0 top  (outside the outline)
R8  -128.27,105.41 0 top  (outside the outline)
R9  -21.59,110.49 0 top  (outside the outline)
R10  -39.37,110.49 0 top  (outside the outline)
R11  -57.15,110.49 0 top  (outside the outline)
R12  -74.93,110.49 0 top  (outside the outline)
R13  -92.71,110.49 0 top  (outside the outline)
R14  -110.49,110.49 0 top  (outside the outline)
R15  -128.27,110.49 0 top  (outside the outline)
R16  -21.59,115.57 0 top  (outside the outline)
R17  -39.37,115.57 0 top  (outside the outline)
R18  -57.15,115.57 0 top  (outside the outline)
R19  -74.93,115.57 0 top  (outside the outline)
R20  -92.71,115.57 0 top  (outside the outline)
R21  -110.49,115.57 0 top  (outside the outline)
R22  -128.27,115.57 0 top  (outside the outline)
R23  -21.59,120.65 0 top  (outside the outline)
R24  -39.37,120.65 0 top  (outside the outline)
R25  -57.15,120.65 0 top  (outside the outline)
R26  -74.93,120.65 0 top  (outside the outline)
R27  -92.71,120.65 0 top  (outside the outline)
R28  -110.49,120.65 0 top  (outside the outline)
R29  -128.27,120.65 0 top  (outside the outline)
R30  -21.59,125.73 0 top  (outside the outline)
R31  -39.37,125.73 0 top  (outside the outline)
R32  -57.15,125.73 0 top  (outside the outline)
R33  -74.93,125.73 0 top  (outside the outline)
R34  -92.71,125.73 0 top  (outside the outline)
R35  -110.49,125.73 0 top  (outside the outline)
R36  -128.27,125.73 0 top  (outside the outline)
R37  -21.59,130.81 0 top  (outside the outline)
R38  -39.37,130.81 0 top  (outside the outline)
R39  -57.15,130.81 0 top  (outside the outline)
R40  -74.93,130.81 0 top  (outside the outline)
R41  -92.71,130.81 0 top  (outside the outline)
R42  -110.49,130.81 0 top  (outside the outline)
R43  -128.27,130.81 0 top  (outside the outline)
R44  -21.59,135.89 0 top  (outside the outline)
R45  -39.37,135.89 0 top  (outside the outline)
R46  -57.15,135.89 0 top  (outside the outline)
R47  -74.93,135.89 0 top  (outside the outline)
R48  -92.71,135.89 0 top  (outside the outline)
R49  -110.49,135.89 0 top  (outside the outline)
R50  -128.27,135.89 0 top  (outside the outline)
R51  -21.59,140.97 0 top  (outside the outline)
R52  -39.37,140.97 0 top  (outside the outline)
R53  -57.15,140.97 0 top  (outside the outline)
R54  -74.93,140.97 0 top  (outside the outline)
R55  -92.71,140.97 0 top  (outside the outline)
R56  -110.49,140.97 0 top  (outside the outline)
R57  -128.27,140.97 0 top  (outside the outline)
R58  -21.59,146.05 0 top  (outside the outline)
R59  -39.37,146.05 0 top  (outside the outline)
R60  -57.15,146.05 0 top  (outside the outline)
R61  -74.93,146.05 0 top  (outside the outline)
R62  -92.71,146.05 0 top  (outside the outline)
R63  -110.49,146.05 0 top  (outside the outline)
R64  -128.27,146.05 0 top  (outside the outline)

### Tracks (layer width: path | path; a pad name or v marks a point on that pad's centre or on a via)
AND1_B1
  Top 0.152: IC33.3 219.71,36.83 218.44,38.1 218.44,47.16 IC42.1
AND1_B2
  Top 0.152: IC33.6 222.25,33.02 223.52,34.29 223.52,39.37 222.25,40.64 219.71,40.64 219.71,45.72 IC42.4
AND1_B3
  Top 0.152: IC33.11 224.79,35.56 224.16,36.2 224.16,45.72 225.43,46.99 IC42.12
AND1_B4
  Top 0.152: IC33.8 226.69,31.75 227.97,33.02 227.97,42.55 227.33,43.18 IC42.9
AND1_B5  (1 unrouted)
AND1_B6  (1 unrouted)
AND1_B7  (1 unrouted)
AND1_B8  (1 unrouted)
AND1_B9  (1 unrouted)
AND1_B10  (1 unrouted)
AND1_B11  (1 unrouted)
AND1_B12  (1 unrouted)
AND1_B13  (1 unrouted)
AND1_B14  (1 unrouted)
AND1_B15  (1 unrouted)
AND1_B16  (1 unrouted)
AND1_B17  (1 unrouted)
AND1_B18  (1 unrouted)
AND1_B19  (1 unrouted)
AND1_B20  (1 unrouted)
AND1_B21  (1 unrouted)
AND1_B22  (1 unrouted)
AND1_B23  (1 unrouted)
AND1_B24  (1 unrouted)
AND1_B25  (1 unrouted)
AND1_B26  (1 unrouted)
AND1_B27  (1 unrouted)
AND1_B28  (1 unrouted)
AND1_B29  (1 unrouted)
AND1_B30  (1 unrouted)
AND1_B31  (1 unrouted)
AND1_B32  (1 unrouted)
AND2_B1
  Top 0.152: IC25.3 219.71,57.15 219.71,50.8 222.25,50.8 222.25,49.7 IC42.2
AND2_B2
  Top 0.152: IC42.5 220.98,44.45 223.52,46.99 223.52,53.34 IC25.6
AND2_B3
  Top 0.152: IC25.11 224.79,55.88 224.79,49.7 IC42.13
AND2_B4
  Top 0.152: IC25.8 227.33,50.72 227.33,44.45 IC42.10
AND2_B5  (1 unrouted)
AND2_B6  (1 unrouted)
AND2_B7  (1 unrouted)
AND2_B8  (1 unrouted)
AND2_B9  (1 unrouted)
AND2_B10  (1 unrouted)
AND2_B11  (1 unrouted)
AND2_B12  (1 unrouted)
AND2_B13  (1 unrouted)
AND2_B14  (1 unrouted)
AND2_B15  (1 unrouted)
AND2_B16  (1 unrouted)
AND2_B17  (1 unrouted)
AND2_B18  (1 unrouted)
AND2_B19  (1 unrouted)
AND2_B20  (1 unrouted)
AND2_B21  (1 unrouted)
AND2_B22  (1 unrouted)
AND2_B23  (1 unrouted)
AND2_B24  (1 unrouted)
AND2_B25  (1 unrouted)
AND2_B26  (1 unrouted)
AND2_B27  (1 unrouted)
AND2_B28  (1 unrouted)
AND2_B29  (1 unrouted)
AND2_B30  (1 unrouted)
AND2_B31  (1 unrouted)
AND2_B32  (1 unrouted)
CIN1  (2 unrouted)
CIN2  (2 unrouted)
CIN3  (2 unrouted)
CIN4  (2 unrouted)
CIN5  (2 unrouted)
CIN6  (2 unrouted)
CIN7  (2 unrouted)
CIN8  (2 unrouted)
CIN9  (2 unrouted)
CIN10  (2 unrouted)
CIN11  (2 unrouted)
CIN12  (2 unrouted)
CIN13  (2 unrouted)
CIN14  (2 unrouted)
CIN15  (2 unrouted)
CIN16  (2 unrouted)
CIN17  (2 unrouted)
CIN18  (2 unrouted)
CIN19  (2 unrouted)
CIN20  (2 unrouted)
CIN21  (2 unrouted)
CIN22  (2 unrouted)
CIN23  (2 unrouted)
CIN24  (2 unrouted)
CIN25  (2 unrouted)
CIN26  (2 unrouted)
CIN27  (2 unrouted)
CIN28  (2 unrouted)
CIN29  (2 unrouted)
CIN30  (2 unrouted)
CIN31  (2 unrouted)
D1_B1  (4 unrouted)
D1_B2  (4 unrouted)
D1_B3  (4 unrouted)
D1_B4  (4 unrouted)
D1_B5  (4 unrouted)
D1_B6  (4 unrouted)
D1_B7  (4 unrouted)
D1_B8  (4 unrouted)
D1_B9  (4 unrouted)
D1_B10  (4 unrouted)
D1_B11  (4 unrouted)
D1_B12  (4 unrouted)
D1_B13  (4 unrouted)
D1_B14  (4 unrouted)
D1_B15  (4 unrouted)
D1_B16  (4 unrouted)
D1_B17  (4 unrouted)
D1_B18  (4 unrouted)
D1_B19  (4 unrouted)
D1_B20  (4 unrouted)
D1_B21  (4 unrouted)
D1_B22  (4 unrouted)
D1_B23  (4 unrouted)
D1_B24  (4 unrouted)
D1_B25  (4 unrouted)
D1_B26  (4 unrouted)
D1_B27  (4 unrouted)
D1_B28  (4 unrouted)
D1_B29  (4 unrouted)
D1_B30  (4 unrouted)
D1_B31  (4 unrouted)
D1_B32  (4 unrouted)
D2_B1  (4 unrouted)
D2_B2  (4 unrouted)
D2_B3  (4 unrouted)
D2_B4  (4 unrouted)
D2_B5  (4 unrouted)
D2_B6  (4 unrouted)
D2_B7  (4 unrouted)
D2_B8  (4 unrouted)
D2_B9  (4 unrouted)
D2_B10  (4 unrouted)
D2_B11  (4 unrouted)
D2_B12  (4 unrouted)
D2_B13  (4 unrouted)
D2_B14  (4 unrouted)
D2_B15  (4 unrouted)
D2_B16  (4 unrouted)
D2_B17  (4 unrouted)
D2_B18  (4 unrouted)
D2_B19  (4 unrouted)
D2_B20  (4 unrouted)
D2_B21  (4 unrouted)
D2_B22  (4 unrouted)
D2_B23  (4 unrouted)
D2_B24  (4 unrouted)
D2_B25  (4 unrouted)
D2_B26  (4 unrouted)
D2_B27  (4 unrouted)
D2_B28  (4 unrouted)
D2_B29  (4 unrouted)
D2_B30  (4 unrouted)
D2_B31  (4 unrouted)
D2_B32  (4 unrouted)
GND  (159 unrouted)
INV_B1
  Top 0.152: IC17.3 209.93,76.75 209.79,76.75 209.55,76.51 209.55,68.58 IC1.2
INV_B2
  Top 0.152: IC17.6 211.36,72.94 211.5,72.94 211.64,72.81 211.64,65.62 211.5,65.49 211.36,65.49 IC1.5
INV_B3  (1 unrouted)
  Top 0.152: 215.9,68.58 215.9,68.61 215.08,69.43 215.08,75.35 215.22,75.48 215.36,75.48 IC17.11
INV_B4
  Top 0.152: IC17.8 216.07,71.26 217.06,70.27 217.06,65.62 216.93,65.49 216.79,65.49 IC1.10
INV_B5  (1 unrouted)
INV_B6  (1 unrouted)
INV_B7  (1 unrouted)
INV_B8  (1 unrouted)
INV_B9  (1 unrouted)
INV_B10  (1 unrouted)
INV_B11  (1 unrouted)
INV_B12  (1 unrouted)
INV_B13  (1 unrouted)
INV_B14  (1 unrouted)
INV_B15  (1 unrouted)
INV_B16  (1 unrouted)
INV_B17  (1 unrouted)
INV_B18  (1 unrouted)
INV_B19  (1 unrouted)
INV_B20  (1 unrouted)
INV_B21  (1 unrouted)
INV_B22  (1 unrouted)
INV_B23  (1 unrouted)
INV_B24  (1 unrouted)
INV_B25  (1 unrouted)
INV_B26  (1 unrouted)
INV_B27  (1 unrouted)
INV_B28  (1 unrouted)
INV_B29  (1 unrouted)
INV_B30  (1 unrouted)
INV_B31  (1 unrouted)
INV_B32  (1 unrouted)
SUB  (33 unrouted)
SUM_B1  (2 unrouted)
  Top 0.152: IC9.3 209.93,56.43 209.79,56.43 209.55,56.19 209.55,48.26
SUM_B2  (2 unrouted)
  Top 0.152: IC9.6 211.36,52.62 211.5,52.62 212.09,52.04 212.09,48.26
SUM_B3  (2 unrouted)
  Top 0.152: IC9.11 215.36,55.16 215.22,55.16 214.63,54.58 214.63,48.26
SUM_B4  (2 unrouted)
  Top 0.152: IC9.8 217.17,50.97 217.17,48.26
SUM_B5  (2 unrouted)
SUM_B6  (2 unrouted)
SUM_B7  (2 unrouted)
SUM_B8  (2 unrouted)
SUM_B9  (2 unrouted)
SUM_B10  (2 unrouted)
SUM_B11  (2 unrouted)
SUM_B12  (2 unrouted)
SUM_B13  (2 unrouted)
SUM_B14  (2 unrouted)
SUM_B15  (2 unrouted)
SUM_B16  (2 unrouted)
SUM_B17  (2 unrouted)
SUM_B18  (2 unrouted)
SUM_B19  (2 unrouted)
SUM_B20  (2 unrouted)
SUM_B21  (2 unrouted)
SUM_B22  (2 unrouted)
SUM_B23  (2 unrouted)
SUM_B24  (2 unrouted)
SUM_B25  (2 unrouted)
SUM_B26  (2 unrouted)
SUM_B27  (2 unrouted)
SUM_B28  (2 unrouted)
SUM_B29  (2 unrouted)
SUM_B30  (2 unrouted)
SUM_B31  (2 unrouted)
SUM_B32  (2 unrouted)
VCC  (95 unrouted)
XOR_B1  (1 unrouted)
  Top 0.152: IC1.3 209.93,66.59 209.79,66.59 209.55,66.35 209.55,59.69 IC9.1
XOR_B2  (1 unrouted)
  Top 0.152: IC1.6 211.36,62.78 211.5,62.78 211.64,62.65 211.64,56.73 211.5,56.6 211.36,56.6 IC9.4
XOR_B3  (2 unrouted)
  Top 0.152: 215.9,57.15 215.9,57.18 215.08,58 215.08,65.19 215.22,65.32 215.36,65.32 IC1.11
XOR_B4  (1 unrouted)
  Top 0.152: IC1.8 216.07,61.1 217.06,60.11 217.06,54.19 216.93,54.06 216.79,54.06 IC9.9
XOR_B5  (2 unrouted)
XOR_B6  (2 unrouted)
XOR_B7  (2 unrouted)
XOR_B8  (2 unrouted)
XOR_B9  (2 unrouted)
XOR_B10  (2 unrouted)
XOR_B11  (2 unrouted)
XOR_B12  (2 unrouted)
XOR_B13  (2 unrouted)
XOR_B14  (2 unrouted)
XOR_B15  (2 unrouted)
XOR_B16  (2 unrouted)
XOR_B17  (2 unrouted)
XOR_B18  (2 unrouted)
XOR_B19  (2 unrouted)
XOR_B20  (2 unrouted)
XOR_B21  (2 unrouted)
XOR_B22  (2 unrouted)
XOR_B23  (2 unrouted)
XOR_B24  (2 unrouted)
XOR_B25  (2 unrouted)
XOR_B26  (2 unrouted)
XOR_B27  (2 unrouted)
XOR_B28  (2 unrouted)
XOR_B29  (2 unrouted)
XOR_B30  (2 unrouted)
XOR_B31  (2 unrouted)
XOR_B32  (2 unrouted)